# Altium schematic sheet teensy.SchDoc
size A
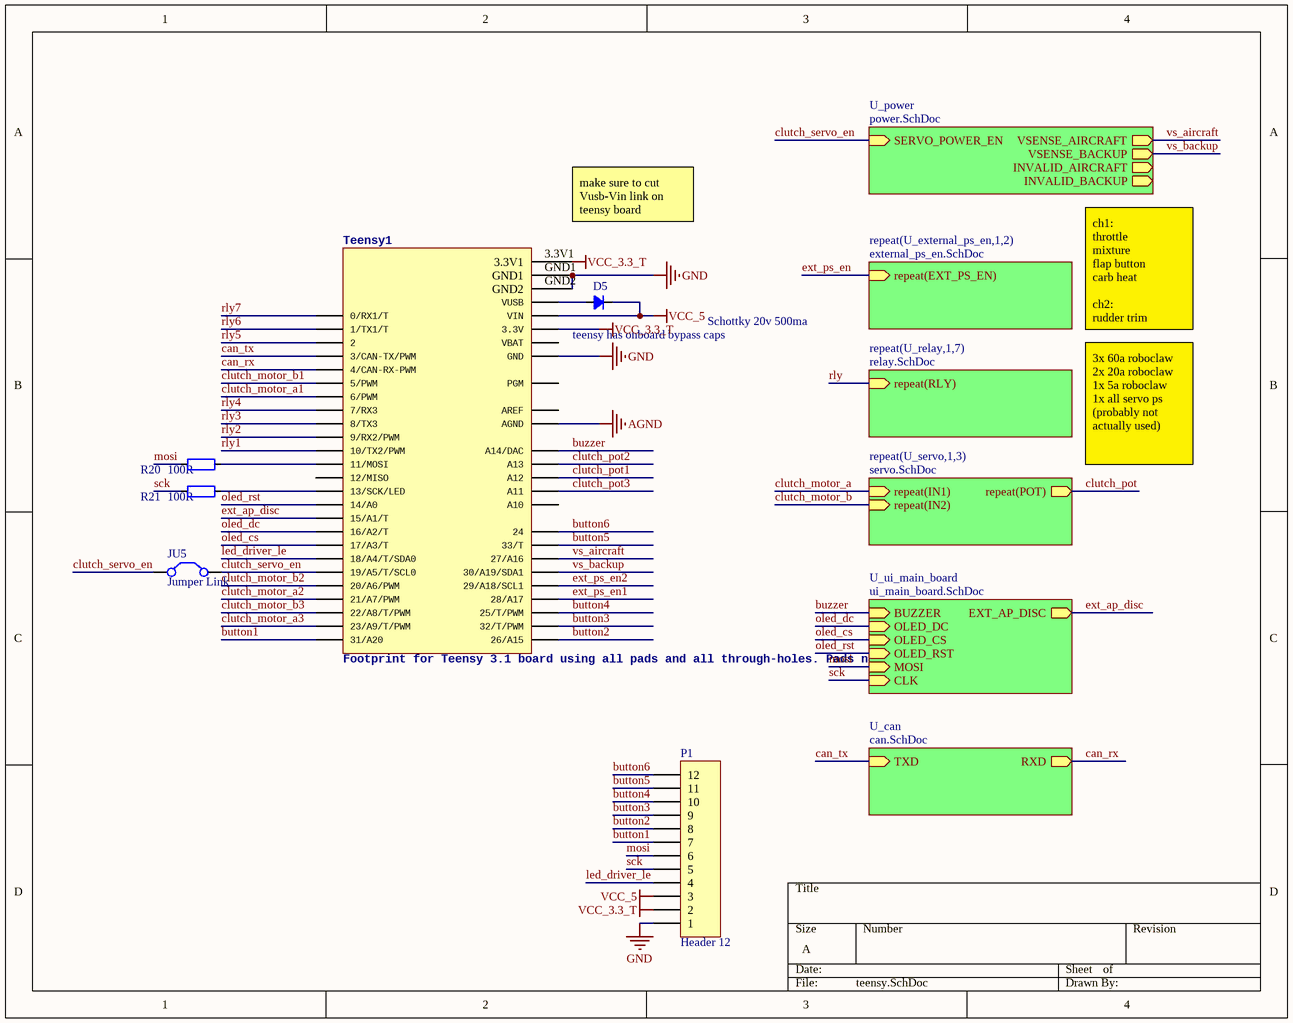
[diagram p0: teensy.SchDoc]

## Parts
D5  value Schottky 20v 500ma  [SOD123F]  (hidden comment: Diode_SOD523)
JU5  Jumper Link  [jumper_62.4_9]
P1  Header 12  [HDR1X12]
R20  value 100R  [RES_0603]  (hidden comment: Res_0603)
R21  value 100R  [RES_0603]  (hidden comment: Res_0603)
Teensy1  Footprint for Teensy 3.1 board using all pads and all through-holes. Pads need a 2x7 0.1" SMD header.  [TEENSY_3.1_ALLPINS]

## Sub-sheets
repeat(U_external_ps_en,1,2) = external_ps_en.SchDoc: repeat(EXT_PS_EN) (in)
repeat(U_relay,1,7) = relay.SchDoc: repeat(RLY) (in)
repeat(U_servo,1,3) = servo.SchDoc: repeat(IN1) (in), repeat(IN2) (in), repeat(POT) (out)
U_can = can.SchDoc: TXD (in), RXD (out)
U_power = power.SchDoc: SERVO_POWER_EN (in), VSENSE_AIRCRAFT (out), VSENSE_BACKUP (out), INVALID_AIRCRAFT (out), INVALID_BACKUP (out)
U_ui_main_board = ui_main_board.SchDoc: EXT_AP_DISC (out), BUZZER (in), OLED_DC (in), OLED_CS (in), OLED_RST (in), MOSI (in), CLK (in)

## Nets
AGND: Teensy1.AGND
GND: P1.1 Teensy1.GND Teensy1.GND1 Teensy1.GND2
VCC_3.3_T: P1.2 Teensy1.3.3V Teensy1.3.3V1
VCC_5: D5.2(K) P1.3 Teensy1.VIN
button1: P1.7 Teensy1.31(31/A20)
button2: P1.8 Teensy1.26(26/A15)
button3: P1.9 Teensy1.32(32/T/PWM)
button4: P1.10 Teensy1.25(25/T/PWM)
button5: P1.11 Teensy1.33(33/T)
button6: P1.12 Teensy1.24
buzzer: Teensy1.A14(A14/DAC) ; sheet U_ui_main_board/BUZZER
can_rx: Teensy1.4(4/CAN-RX-PWM) ; sheet U_can/RXD
can_tx: Teensy1.3(3/CAN-TX/PWM) ; sheet U_can/TXD
clutch_motor_a: sheet repeat(U_servo,1,3)/repeat(IN1)
clutch_motor_a1: Teensy1.6(6/PWM)
clutch_motor_a2: Teensy1.21/A7(21/A7/PWM)
clutch_motor_a3: Teensy1.23/A9(23/A9/T/PWM)
clutch_motor_b: sheet repeat(U_servo,1,3)/repeat(IN2)
clutch_motor_b1: Teensy1.5(5/PWM)
clutch_motor_b2: Teensy1.20/A6(20/A6/PWM)
clutch_motor_b3: Teensy1.22/A8(22/A8/T/PWM)
clutch_pot: sheet repeat(U_servo,1,3)/repeat(POT)
clutch_pot1: Teensy1.A12
clutch_pot2: Teensy1.A13
clutch_pot3: Teensy1.A11
clutch_servo_en: JU5.1(C1) JU5.2(C2) Teensy1.19/A5(19/A5/T/SCL0) ; sheet U_power/SERVO_POWER_EN
ext_ap_disc: Teensy1.15/A1(15/A1/T) ; sheet U_ui_main_board/EXT_AP_DISC
ext_ps_en: sheet repeat(U_external_ps_en,1,2)/repeat(EXT_PS_EN)
ext_ps_en1: Teensy1.28(28/A17)
ext_ps_en2: Teensy1.29(29/A18/SCL1)
led_driver_le: P1.4 Teensy1.18/A4(18/A4/T/SDA0)
mosi: P1.6 R20.1 ; sheet U_ui_main_board/MOSI
oled_cs: Teensy1.17/A3(17/A3/T) ; sheet U_ui_main_board/OLED_CS
oled_dc: Teensy1.16/A2(16/A2/T) ; sheet U_ui_main_board/OLED_DC
oled_rst: Teensy1.14/A0 ; sheet U_ui_main_board/OLED_RST
rly: sheet repeat(U_relay,1,7)/repeat(RLY)
rly1: Teensy1.10(10/TX2/PWM)
rly2: Teensy1.9(9/RX2/PWM)
rly3: Teensy1.8(8/TX3)
rly4: Teensy1.7(7/RX3)
rly5: Teensy1.2
rly6: Teensy1.1(1/TX1/T)
rly7: Teensy1.0(0/RX1/T)
sck: P1.5 R21.1 ; sheet U_ui_main_board/CLK
vs_aircraft: Teensy1.27(27/A16) ; sheet U_power/VSENSE_AIRCRAFT
vs_backup: Teensy1.30(30/A19/SDA1) ; sheet U_power/VSENSE_BACKUP
NetD5_1: D5.1(A) Teensy1.VUSB
NetR20_2: R20.2 Teensy1.11(11/MOSI)
NetR21_2: R21.2 Teensy1.13(13/SCK/LED)

Not connected (* = marked no-connect by the designer): Teensy1 12(12/MISO) A10 AREF PGM VBAT

## Notes on the sheet
- make sure to cut Vusb-Vin link on teensy board
- teensy has onboard bypass caps
- ch1:
  throttle
  mixture
  flap button
  carb heat
  ch2:
  rudder trim
- 3x 60a roboclaw
  2x 20a roboclaw
  1x 5a roboclaw
  1x all servo ps (probably not actually used)

## Library data of the parts
D5 = Diode_SOD523: Diode; url: http://www.digikey.com/product-detail/en/nxp-usa-inc/PMEG2010AEB,115/568-6502-1-ND/2531789
JU5 = Jumper: Jumper Wire; Published: 24-Mar-1999; LatestRevisionDate: 17-Jul-2002; LatestRevisionNote: Re-released for DXP Platform.; PackageReference: RAD-0.2; Publisher: Altium Limited; PackageDescription: Radial Cap, Thru-Hole; 2 Leads; 0.2 in Pin Spacing; ClassName: no-clearance-check
P1 = Header 12: Header, 12-Pin; LatestRevisionDate: 17-Jul-2002; LatestRevisionNote: Re-released for DXP Platform.; Publisher: Altium Limited
R20 R21 = Res_0603: Resistor
Teensy1 = TEENSY_3.1_ALL_PINS_AND_PADS